# EAGLE design rapidshark-half-assed-half-h-bridge-mk-2.2 (EAGLE 7.5.0)
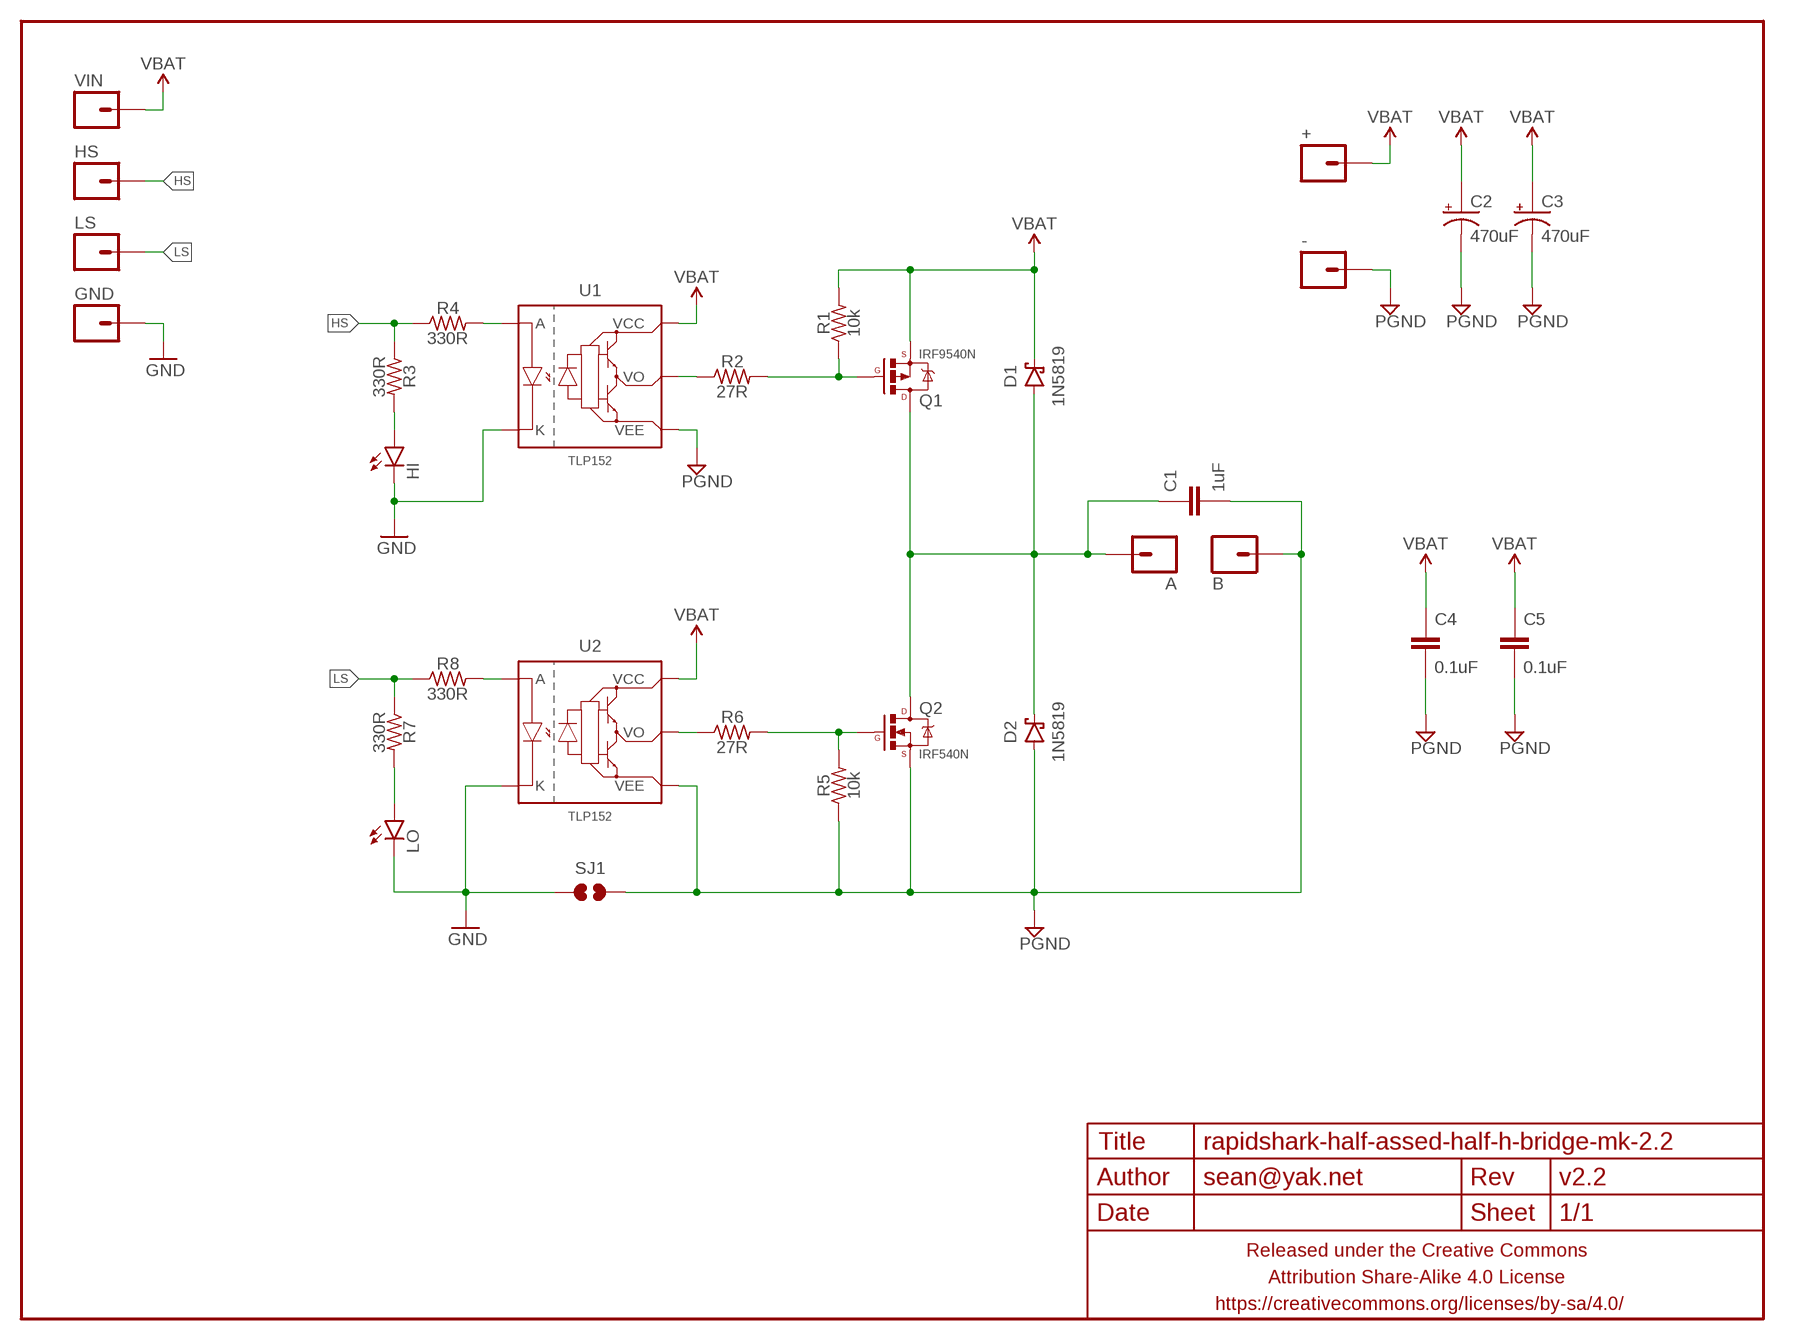
[diagram p0: schematic, sheet 1]

## Parts
+  M01PTH-1.9MM  [1X01-1.9MM-CIR]
-  M01PTH-1.9MM  [1X01-1.9MM-CIR]
A  M01PTH-1.9MM  [1X01-1.9MM-CIR]
B  M01PTH-1.9MM  [1X01-1.9MM-CIR]
C1  1uF  CAPACITOR-CERAMICC0603-TIGHTER  [C0603-TIGHTER]
C2  470uF  CAPACITOR-POLARIZEDE5-10.5  [E5-10,5]
C3  470uF  CAPACITOR-POLARIZEDE5-10.5  [E5-10,5]
C4  0.1uF  CAPACITOR-CERAMICC0603-TIGHTER  [C0603-TIGHTER]
C5  0.1uF  CAPACITOR-CERAMICC0603-TIGHTER  [C0603-TIGHTER]
D1  1N5819  DIODE-SCHOTTKYSMA  [SMA-DIODE-SCHOTTKY]
D2  1N5819  DIODE-SCHOTTKYSMA  [SMA-DIODE-SCHOTTKY]
FRAME1  FRAME-LETTERNO_PACKAGE  [DUMMY]
GND  M01PTH  [1X01]
HI  LED0603-TIGHT  [LED-0603-TIGHT]
HS  M01PTH  [1X01]
LO  LED0603-TIGHT  [LED-0603-TIGHT]
LS  M01PTH  [1X01]
Q1  IRF9540N  MOSFET-PCHANNELD2PAK  [D2PAK]
Q2  IRF540N  MOSFET-NCHANNELD2PAK  [D2PAK]
R1  10k  RESISTORR0603-TIGHTER  [R0603-TIGHTER]
R2  27R  RESISTORR0603-TIGHTER  [R0603-TIGHTER]
R3  330R  RESISTORR0603-TIGHTER  [R0603-TIGHTER]
R4  330R  RESISTORR0603-TIGHTER  [R0603-TIGHTER]
R5  10k  RESISTORR0603-TIGHTER  [R0603-TIGHTER]
R6  27R  RESISTORR0603-TIGHTER  [R0603-TIGHTER]
R7  330R  RESISTORR0603-TIGHTER  [R0603-TIGHTER]
R8  330R  RESISTORR0603-TIGHTER  [R0603-TIGHTER]
SJ1  JUMPER-PAD-2-NO  [PAD-JUMPER-2-NO_NO_SILK]
U1  TLP152  OPTOISOLATOR-GATEDRIVERSOIC05  [SO05]
U2  TLP152  OPTOISOLATOR-GATEDRIVERSOIC05  [SO05]
VIN  M01PTH  [1X01]

## Nets
A: A.P$1 C1.1 D1.A D2.C Q1.D Q2.D
GND: GND.1 HI.C LO.C SJ1.1 U1.3(K) U2.3(K)
HS: HS.1 R3.1 R4.1
LS: LS.1 R7.1 R8.1
N$1: Q2.G R5.2 R6.2
N$2: R2.1 U1.5(VO)
N$3: LO.A R7.2
N$4: HI.A R3.2
N$5: Q1.G R1.1 R2.2
N$6: R4.2 U1.1(A)
N$7: R8.2 U2.1(A)
N$8: R6.1 U2.5(VO)
PGND: -.P$1 B.P$1 C1.2 C2.- C3.- C4.2 C5.2 D2.A Q2.S R5.1 SJ1.2 U1.4(VEE) U2.4(VEE)
VBAT: +.P$1 C2.+ C3.+ C4.1 C5.1 D1.C Q1.S R1.2 U1.6(VCC) U2.6(VCC) VIN.1

## Library data of the parts
+ - A B GND HS LS VIN = a_parts:M01: Header 1 Standard 1-pin 0.1" header. Use with straight break away headers (SKU : PRT-00116), right angle break away headers (PRT-00553), swiss pins (PRT-00743), machine pins (PRT-00117), and female headers (PRT-00115).
C1 C4 C5 = a_parts:CAPACITOR-CERAMIC: CAPACITOR, European symbol
C2 C3 = a_parts:CAPACITOR-POLARIZED: POLARIZED CAPACITOR, American symbol
D1 D2 = a_parts:DIODE-SCHOTTKY: Schottky diodes in SFE's production catalog BAT20J 1A 23V 0.62Vf RB751 120mA 40V 0.37Vf PMEG4005EJ 0.5A 40V 0.42Vf MBRA140 1A 40V 0.5Vf B340A 3A 40V SMA
FRAME1 = A_butts:FRAME-LETTER: Schematic Frame Standard 8.5x11 US Letter frame; DESIGNER: sean@yak.net; VERSION: v2.2
HI LO = a_parts:LED: LEDs Standard schematic elements and footprints for 5mm, 3mm, 1206, and 0603 sized LEDs. 5mm - Spark Fun Electronics SKU : COM-00529 (and others)
Q1 = a_parts:MOSFET-PCHANNEL: Generic PMOSFET IRLML2244 - TRANS-11153 (SOT-23 -20V -4.3A) (1.Gate 2.Source 3.Drain) FQP27P06 - COM-10349 <http://www.sparkfun.com/products/10349> (TO-220 -60V -27A) (1.Gate 2.Source 3.Drain)
Q2 = a_parts:MOSFET-NCHANNEL: Common NMOSFET Parts MFG P/N Store ID Prod ID FDD8780 TRANS-09984 SI7820DN TRANS-11055 FDS6630A IC-08089 2N7002PW TRANS-11151 FQP30N06L COM-10213 TRANS-10060 BSS123LT1G TRANS-08345 BSS138 TRANS-00830 BS170 2N7000
R1-R8 = a_parts:RESISTOR: RESISTOR, American symbol
SJ1 = a_parts:JUMPER-PAD-2-NO
U1 U2 = a_parts:OPTOISOLATOR-GATEDRIVER

## Board
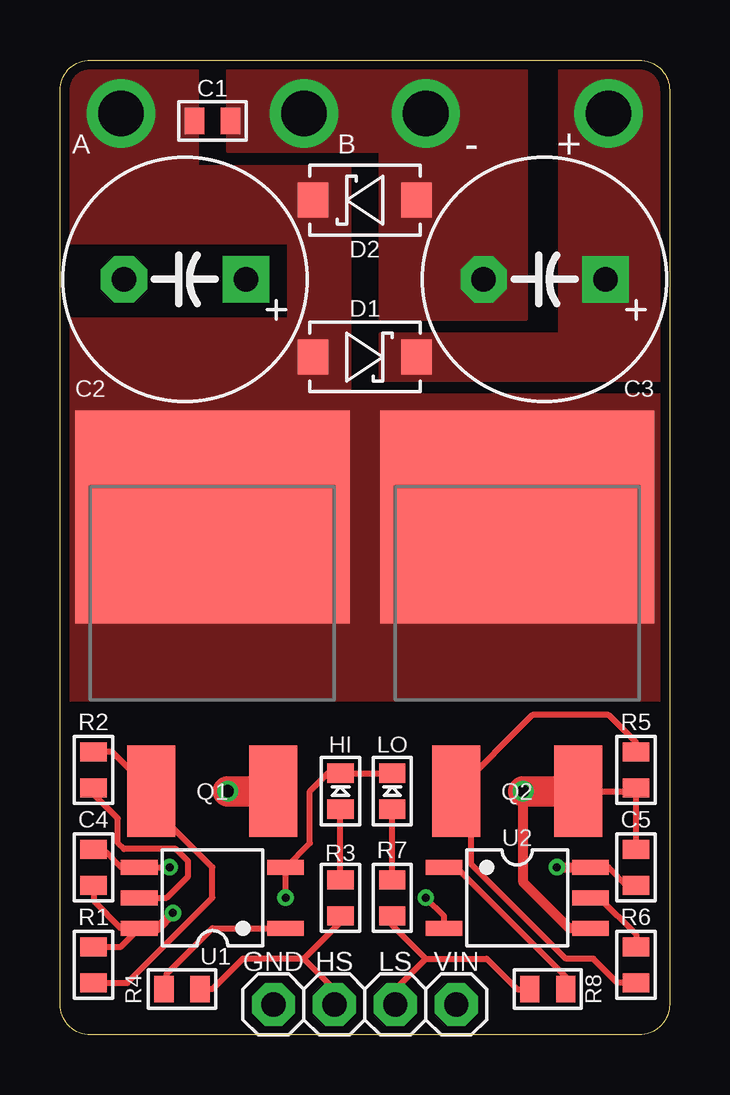
[diagram p1: board, top side]
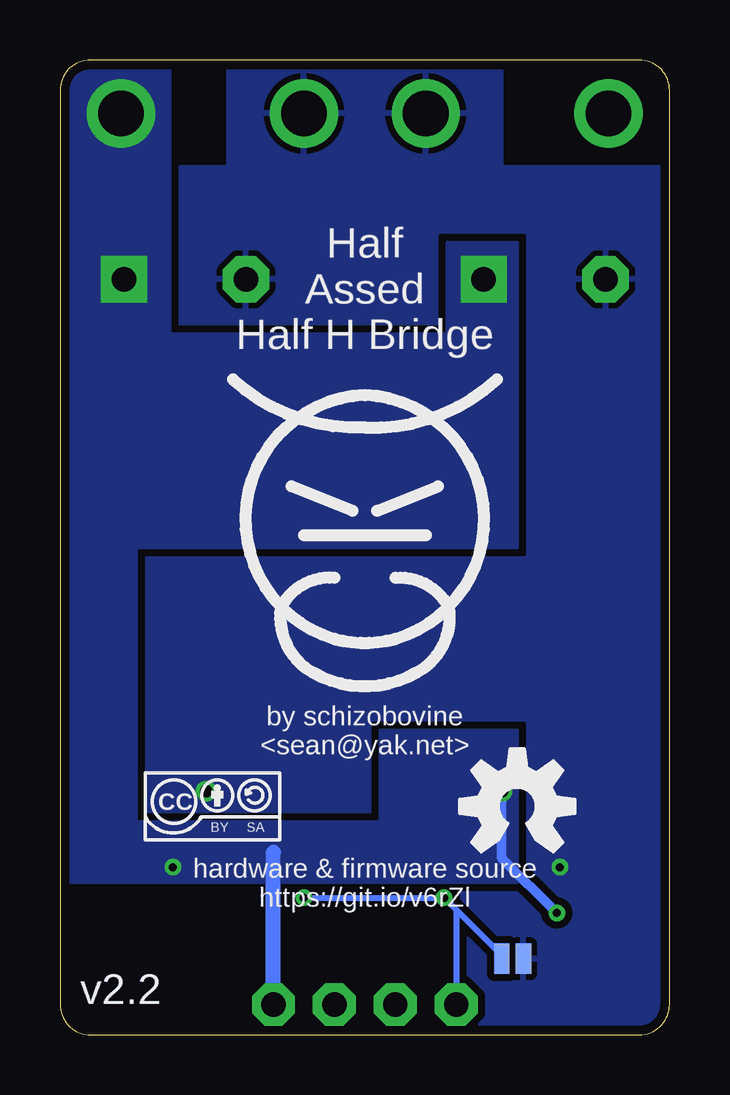
[diagram p2: board, bottom side, seen from below]

Size 25.4 x 40.64 mm. Coordinates in mm from the lower left corner, seen from the top.
Outline: 1.27,40.64 24.13,40.64 arc-90 25.4,39.37 25.4,1.27 arc-90 24.13,0 1.27,0 arc-90 0,1.27 0,39.37 arc-90 1.27,40.64
Copper layers (1*16): Top 0.0356mm / dielectric 1.5011mm / Bottom 0.0356mm
Design rules "LaenPCBOrder_2": minimum track width 6mil, minimum drill 13mil, track to track 6mil, track to pad 6mil, pad to pad 6mil, via to via 6mil, smd to smd 6mil, copper to edge 15mil, drill to drill 6mil, minimum pad ring 7mil, minimum via ring 7mil, stop-mask expansion 3mil, vias tented up to drill 20mil, thermal gap 10mil

### Footprints (pad centres in the part's own frame; a part is rotated, then mirrored left to right if it is on the bottom)
1X01-1.9MM-CIR = drill 1.9 pad 2.6: P$1 0,0
C0603-TIGHTER = smd 0.8 x 1.1: 1 -0.75,0; 2 0.75,0
E5-10,5 = drill 1.016 pad 1.93 square: + -2.54,0 | drill 1.016 pad 1.93 octagon: - 2.54,0
SMA-DIODE-SCHOTTKY = smd 1.27 x 1.47: A -2.15,0; C 2.15,0
1X01 = drill 1.016 pad 1.778 octagon: 1 0,0
LED-0603-TIGHT = smd 0.8 x 1.1: A 0.75,0; C -0.75,0
D2PAK = smd 11.43 x 8.89: D 0,11.43 | smd 2 x 3.81: G -2.54,0; S 2.54,0
R0603-TIGHTER = smd 0.8 x 1.1: 1 -0.75,0; 2 0.75,0
PAD-JUMPER-2-NO_NO_SILK = smd 0.635 x 1.27: 1 -0.45,0; 2 0.45,0
SO05 = smd 0.635 x 1.524: 1 -1.27,-3.048; 3 1.27,-3.048; 4 1.27,3.048; 5 0,3.048; 6 -1.27,3.048

### Placement (x,y rotation side)
+  22.86,38.42 90 top
-  15.24,38.42 270 top
A  2.54,38.42 270 top
B  10.16,38.42 0 top
C1  6.35,38.1 0 top
C2  5.21,31.5 180 top
C3  20.19,31.5 180 top
C4  1.4,6.99 90 top
C5  24,6.99 90 top
D1  12.7,28.26 0 top
D2  12.7,34.8 180 top
FRAME1  0,0 0 bottom
GND  8.89,1.27 0 top
HI  11.68,10.16 270 top
HS  11.43,1.27 0 top
LO  13.84,10.16 270 top
LS  13.97,1.27 0 top
Q1  6.35,10.16 0 top
Q2  19.05,10.16 0 top
R1  1.4,2.92 90 top
R2  1.4,11.05 90 top
R3  11.68,5.71 90 top
R4  5.08,1.91 180 top
R5  24,11.05 90 top
R6  24,2.92 270 top
R7  13.84,5.71 90 top
R8  20.32,1.91 0 top
SJ1  6.54,3.17 0 bottom
U1  6.35,5.71 90 top
U2  19.05,5.71 270 top
U$1  [COW]  12.7,20.32 0 bottom
U$2  [CC-BY-SA-4.0-NO-URL]  19.05,9.53 0 bottom
U$3  [OSHWLOGO_5MM]  6.35,9.53 0 bottom
VIN  16.51,1.27 0 top

### Tracks (layer width: path | path; a pad name or v marks a point on that pad's centre or on a via)
A
  pour Top (rank 5, no thermals): 25.4,13.97 0,13.97 0,29.84 9.53,29.84 9.53,33.02 0,33.02 0,39.37 arc-90 1.27,40.64 5.71,40.64 5.71,36.2 12.06,36.2 12.06,26.67 25.4,26.67
GND  (via drill 0.33)
  Top 0.254: LO.C HI.C 11.16,10.91 10.41,10.16 10.41,8 U1.3 v9.4,5.71 | U2.3 16,4.95 v15.24,5.71
  Bottom 0.254: v15.24,5.71 v9.4,5.71 8.89,5.21 | 8.89,5.21 GND.1 | SJ1.1 6.99,3.31 8.89,5.21
HS
  Top 0.254: HS.1 11.43,1.91 10.16,3.17 | 10.16,3.17 7.62,3.17 6.35,1.91 R4.1 | R3.1 11.68,4.7 10.16,3.17
LS
  Top 0.254: LS.1 13.97,1.91 15.24,3.17 | 15.24,3.17 17.78,3.17 19.05,1.91 R8.1 | R7.1 13.84,4.57 15.24,3.17
N$1
  Top 0.254: R6.2 23.23,2.17 22.23,3.17 21.08,3.17 17.14,7.11 17.14,9.53 Q2.G 19.68,13.34 22.86,13.34 24,12.19 R5.2
N$2
  Top 0.254: U1.5 4.45,5.71 5.33,6.6 5.33,7.24 4.83,7.75 2.67,7.75 2.41,8 2.41,9.02 1.4,10.03 R2.1
N$3
  Top 0.254: R7.2 LO.A
N$4
  Top 0.254: R3.2 HI.A
N$5
  Top 0.254: R1.1 2.81,2.17 6.35,5.71 6.35,6.99 3.81,9.53 Q1.G 2.17,11.8 R2.2
N$6
  Top 0.254: R4.2 4.45,2.02 4.45,2.54 6.35,4.45 U1.1
N$7
  Top 0.254: U2.1 16.51,6.99 21.07,2.42 R8.2
N$8
  Top 0.254: U2.5 22.48,5.71 24,4.19 R6.1
PGND  (via drill 0.33, 0.51)
  Top 0.254: C4.2 1.51,7.62 1.91,7.62 2.54,6.99 U1.4 v4.57,6.99 | Q2.S 21.84,10.16 23.86,10.16 R5.1 C5.2
  Top 0.406: U2.4 21.21,4.45 19.3,6.35 v19.3,10.16
  Top 1.27: v19.3,10.16 21.84,10.16
  pour Bottom (isolate 0.305, rank 5): 0,1.27 0,36.2 6.99,36.2 6.99,40.64 18.41,40.64 18.41,36.2 25.4,36.2 25.4,1.27 arc-90 24.13,0 1.27,0 arc-90
  pour Top (rank 5, no thermals): 6.99,40.64 6.99,36.83 13.34,36.83 13.34,29.84 19.43,29.84 19.43,40.64
VBAT  (via drill 0.33, 0.51)
  Top 0.254: R1.2 2.53,3.67 U1.6 2.54,4.45 1.4,5.59 C4.1 | U2.6 22.86,6.99 23.62,6.22 23.99,6.22 C5.1
  Top 0.406: U1.6 4.06,4.45 v4.7,5.08 | v20.7,6.99 U2.6
  Top 1.27: Q1.S v6.99,10.16
  Bottom 0.406: v4.7,5.08 6.99,7.37 v6.99,10.16
  Bottom 0.635: VIN.1 16.51,7.62
  pour Top (rank 5, no thermals): 13.34,29.21 13.34,27.3 25.4,27.3 25.4,39.37 arc90 24.13,40.64 20.83,40.64 20.83,29.21
  pour Bottom (rank 4, no thermals): 20.83,40.64 20.83,29.21 9.27,29.21 9.27,33.02 6.35,33.02 6.35,20.32 22.23,20.32 22.23,8.89 12.06,8.89 12.06,12.7 6.35,12.7 6.35,6.35 25.4,6.35 25.4,40.64

### Text on the board
bPlace: Half / Assed / Half H Bridge | by schizobovine / <sean@yak.net> | hardware & firmware source / https://git.io/v6rZl